# Altium schematic sheet USB-PROG.SchDoc: USB-PROGRAMMER
size A4; Engineer: M.GUENI; Revision: R0; SheetNumber: 3; SheetTotal: 5
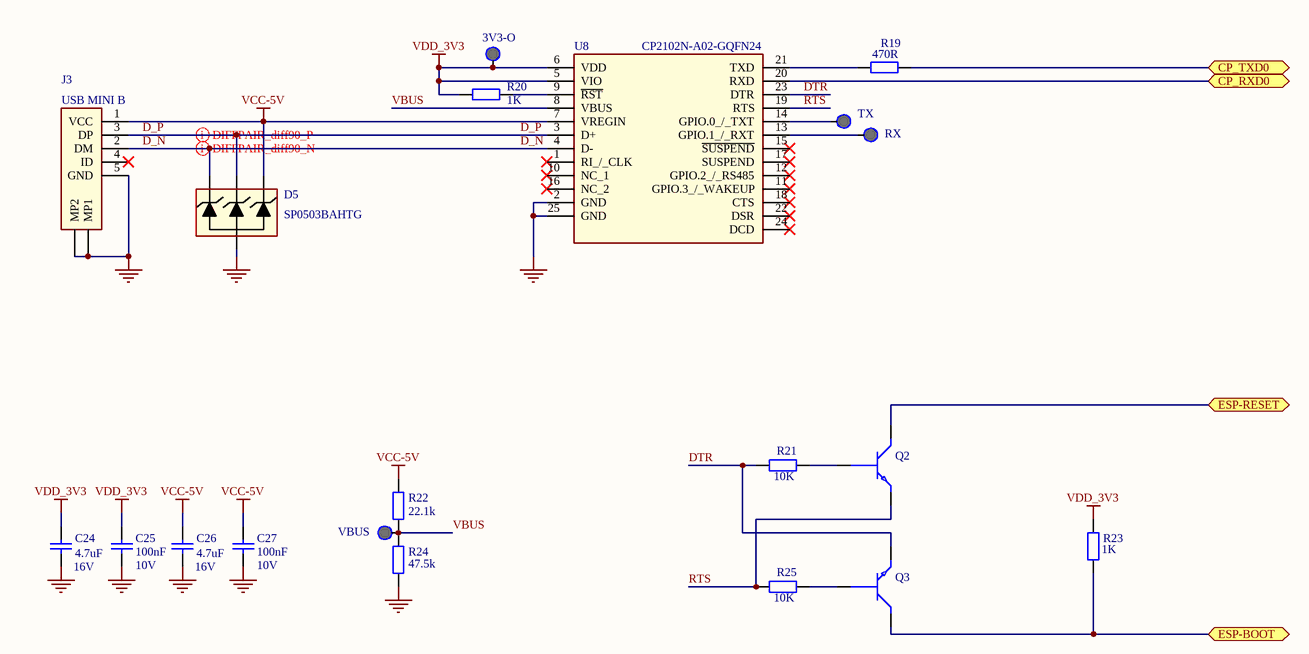
[diagram p0: USB-PROG.SchDoc]

## Parts
3V3-O  Test Point  [TP]  (value not drawn)  (no BOM)
C24  Value 1: 4.7uF  Value 2: 16V  [CAPC1608N]  (hidden comment: Capacitor)
C25  Value 1: 100nF  Value 2: 10V  [CAPC1608N]  (hidden comment: Capacitor)
C26  Value 1: 4.7uF  Value 2: 16V  [CAPC1608N]  (hidden comment: Capacitor)
C27  Value 1: 100nF  Value 2: 10V  [CAPC1608N]  (hidden comment: Capacitor)
D5  SP0503BAHTG  [SOT192P237X122-4N]
J3  USB MINI B  [502237-0517]
Q2  MMSS8050-H-TP  [SOT95P245X112-3N]  (value not drawn)
Q3  MMSS8050-H-TP  [SOT95P245X112-3N]  (value not drawn)
R19  Value 1: 470R  [RESC1608N]  (hidden comment: Resistor)
R20  Value 1: 1K  [RESC1608N]  (hidden comment: Resistor)
R21  Value 1: 10K  [RESC1608N]  (hidden comment: Resistor)
R22  Value 1: 22.1k  [RESC1608N]  (hidden comment: Resistor)
R23  Value 1: 1K  [RESC1608N]  (hidden comment: Resistor)
R24  Value 1: 47.5k  [RESC1608N]  (hidden comment: Resistor)
R25  Value 1: 10K  [RESC1608N]  (hidden comment: Resistor)
RX  Test Point  [TP]  (value not drawn)  (no BOM)
TX  Test Point  [TP]  (value not drawn)  (no BOM)
U8  CP2102N-A02-GQFN24  [QFN50P400X400X80-25N-D]
VBUS  Test Point  [TP]  (value not drawn)  (no BOM)

## Ports
CP_RXD0 (bidir), CP_TXD0 (bidir), ESP-BOOT (bidir), ESP-RESET (bidir)

## Nets
GND: C24.1 C25.1 C26.1 C27.1 D5.1 J3.5(GND) J3.MP1 J3.MP2 R24.1 U8.2(GND) U8.25(GND)
VCC-5V: C26.2 C27.2 D5.4 J3.1(VCC) R22.2 U8.7(VREGIN)
VDD_3V3: 3V3-O.1 C24.2 C25.2 R20.1 R23.2 U8.5(VIO) U8.6(VDD)
CP_RXD0: U8.20(RXD) ; port CP_RXD0
CP_TXD0: R19.2 ; port CP_TXD0
D_N: D5.2 J3.2(DM) U8.4(D-)
D_P: D5.3 J3.3(DP) U8.3(D+)
DTR: Q3.2(E) R21.1 U8.23(DTR)
ESP-BOOT: Q3.3(C) R23.1 ; port ESP-BOOT
ESP-RESET: Q2.3(C) ; port ESP-RESET
RTS: Q2.2(E) R25.1 U8.19(RTS)
VBUS: R22.1 R24.2 U8.8(VBUS) VBUS.1
NetQ2_1: Q2.1(B) R21.2
NetQ3_1: Q3.1(B) R25.2
NetR19_1: R19.1 U8.21(TXD)
NetR20_2: R20.2 U8.9(~{RST})
NetRX_1: RX.1 U8.13(GPIO.1_/_RXT)
NetTX_1: TX.1 U8.14(GPIO.0_/_TXT)

Not connected (* = marked no-connect by the designer): J3 4(ID)*; U8 1(RI_/_CLK)* 10(NC_1)* 11(GPIO.3_/_WAKEUP)* 12(GPIO.2_/_RS485)* 15(~{SUSPEND})* 16(NC_2)* 17(SUSPEND)* 18(CTS)* 22(DSR)* 24(DCD)*

## Layout directives
differential pair; differential pair class Diff90: D_N, D_P

## Notes on the sheet
- Title:
- Micro Device Tunisie
- Size:
- Date:
- File:
- A4
- Engineer :
- Revision:
- Sheet
- of
- Cyber Parc  Hammam Sousse
- Avenue Charles De Gaulle
- 4011, Hammam-Sousse, Tunisie
- contact@mdtunisie.com

## Library data of the parts
3V3-O RX TX VBUS = MIS-000000003: MAN: _; Part Number: MIS-000000003; MANREF: _; DES: _; Value 1: _; Value 2: _; TOL: _; FTP: _; SUP: _; SUPREF: _; NOTE: _
C24 C26 = CAP-000000047: MAN: Murata Electronics; MANREF: GRM188C71C475KE21D; DES: Multilayer Ceramic Capacitors MLCC - SMD/SMT 4.7UF 16V 10% 0603; TOL: 10%; FTP: 0603; SUP: Mouser; SUPREF: 81-GRM188C71C475KE1D; NOTE: _; Part Number: CAP-000000047
C25 C27 = CAP-000000005: MAN: KEMET; MANREF: C0603X104K8RACTU; DES: C0603X104K8RACTU -  Condensateur céramique multicouche CMS, 0.1 µF, 10 V, 0603 [1608 Metric], ± 10%, X7R; TOL: 10%; FTP: 0603; SUP: Farnell; SUPREF: 2904937; NOTE: _; Part Number: CAP-000000005
D5 = TVS-000000002: MAN: Littelfuse; DES: ESD Suppressors / TVS Diodes TVS AVAL DIODE SMT; Value 1: 5.5 V; Value 2: 30 pF; TOL: _; FTP: SOT-143; SUP: Mouser; SUPREF: 576-SP0503BAHTG; Part Number: TVS-000000002; MANREF: SP0503BAHTG; NOTE: _
J3 = CON-000000005: MAN: Molex; DES: USB Connectors USB Mini-B Rec Hsg Assy S/T 5Ckt; Value 1: _; FTP: THT; SUP: Mouser; SUPREF: 538-502237-0517; Part Number: CON-000000005; MANREF: 502237-0517; Value 2: _; TOL: _; NOTE: _
Q2 Q3 = TRP-000000003: MAN: Micro Commercial Components (MCC); DES: Bipolar Transistors - BJT 625mW, 25V, 1500mA; Value 1: 1.5 A; Value 2: 5 V; SUP: Mouser; SUPREF: 833-MMSS8050-H-TP; NOTE: _; Part Number: TRP-000000003; MANREF: MMSS8050-H-TP
R19 = RES-000000016: MAN: YAGEO; MANREF: RC0603FR-10470RL; DES: Thick Film Resistors - SMD 470 OHM 1%; Value 2: 0.1W; TOL: 1%; FTP: 0603; SUP: Mouser; SUPREF: 603-RC0603FR-10470RL; NOTE: _; Part Number: RES-000000016
R20 R23 = RES-000000006: MAN: TE Connectivity / Neohm; MANREF: CPF0603F1K0C1; DES: Thin Film Resistors - SMD 1KOhm .063W 50PPM; Value 2: 0.625W; TOL: 1%; FTP: 0603; SUP: Mouser; SUPREF: 279-CPF0603F1K0C1; NOTE: _; Part Number: RES-000000006
R21 R25 = RES-000000001: MAN: YAGEO; MANREF: RC0603FR-0710KL; DES: YAGEO (PHYCOMP)  RC0603FR-0710KL  RESISTANCE COUCHE EPAISSE 10K 0.1W 1%; Value 2: 0.1W; TOL: 1%; FTP: 0603; SUP: Farnell; SUPREF: 9238603; NOTE: _; Part Number: RES-000000001
R22 = RES-000000017: MAN: Panasonic; MANREF: ERA-3AED2212V; DES: Thin Film Resistors - SMD 0603 22.1Kohms 25ppm 0.5% AEC-Q200; Value 2: 0.1W; TOL: 0.5%; FTP: 0603; SUP: Mouser; SUPREF: 667-ERA-3AED2212V; NOTE: _; Part Number: RES-000000017
R24 = RES-000000018: MAN: Vishay / Dale; MANREF: CRCW060347K5FKEA; DES: Thick Film Resistors - SMD 1/10watt 47.5Kohms 1%; Value 2: 0.1W; TOL: 1%; FTP: 0603; SUP: Mouser; SUPREF: 71-CRCW0603-47.5K-E3; NOTE: _; Part Number: RES-000000018
U8 = MIS-000000025: MAN: SILICON LABS; DES: Circuit intégré d'interface USB USBXpress - USB to UART Bridge QFN24; Value 1: _; FTP: QFN-24; SUP: Mouser; SUPREF: 634-CP2102NA02GQFN24; Part Number: MIS-000000025; MANREF: CP2102N-A02-GQFN24; Value 2: _; TOL: _; NOTE: _